# Altium schematic sheet 5_FTDI.SchDoc
size A4; SheetNumber: 6; SheetTotal: 13
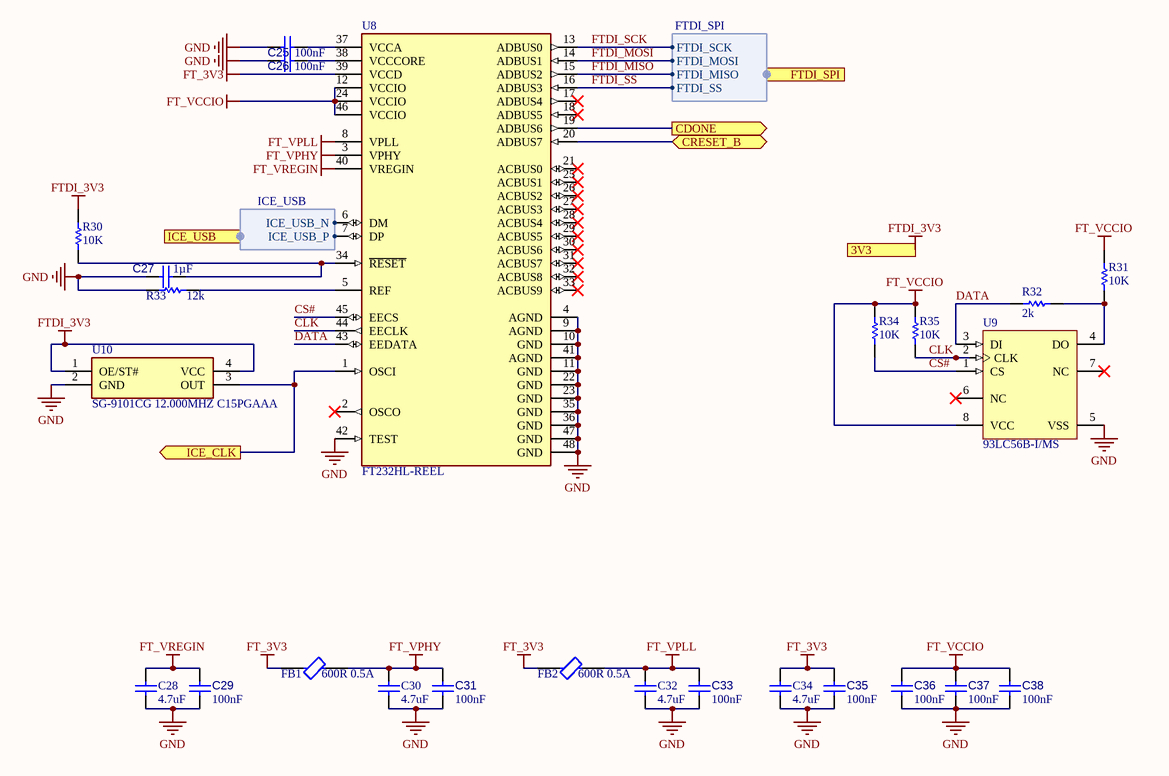
[diagram p0: 5_FTDI.SchDoc]

## Parts
C25  value 100nF  [CAPC1608X90X40NL10T20]  (hidden comment: Capacitor 100 nF +/-10% 50 V 0603)
C26  value 100nF  [CAPC1608X90X40NL10T20]  (hidden comment: Capacitor 100 nF +/-10% 50 V 0603)
C27  value 1µF  [CAPC1608X90X35ML15T15]  (hidden comment: Capacitor 1uF +/- 10% 16V 0603)
C28  4.7uF  [CAPC1608X90X35ML15T15]
C29  value 100nF  [CAPC1608X90X40NL10T20]  (hidden comment: Capacitor 100 nF +/-10% 50 V 0603)
C30  4.7uF  [CAPC1608X90X35ML15T15]
C31  value 100nF  [CAPC1608X90X40NL10T20]  (hidden comment: Capacitor 100 nF +/-10% 50 V 0603)
C32  4.7uF  [CAPC1608X90X35ML15T15]
C33  value 100nF  [CAPC1608X90X40NL10T20]  (hidden comment: Capacitor 100 nF +/-10% 50 V 0603)
C34  4.7uF  [CAPC1608X90X35ML15T15]
C35  value 100nF  [CAPC1608X90X40NL10T20]  (hidden comment: Capacitor 100 nF +/-10% 50 V 0603)
C36  value 100nF  [CAPC1608X90X40NL10T20]  (hidden comment: Capacitor 100 nF +/-10% 50 V 0603)
C37  value 100nF  [CAPC1608X90X40NL10T20]  (hidden comment: Capacitor 100 nF +/-10% 50 V 0603)
C38  value 100nF  [CAPC1608X90X40NL10T20]  (hidden comment: Capacitor 100 nF +/-10% 50 V 0603)
FB1  600R 0.5A  [FP-MMZ1608-0_8-IPC_A]
FB2  600R 0.5A  [FP-MMZ1608-0_8-IPC_A]
R30  10K  [RESC1609X55X30NL10T20]
R31  10K  [RESC1609X55X30NL10T20]
R32  2k  [RESC1609X55X30NL10T20]
R33  12k  [RESC1609X55X30NL10T20]
R34  10K  [RESC1609X55X30NL10T20]
R35  10K  [RESC1609X55X30NL10T20]
U8  FT232HL-REEL  [FP-LQFP-48-MFG]
U9  93LC56B-I/MS  [MSOP-MS8_M]
U10  SG-9101CG 12.000MHZ C15PGAAA  [OSC-SMD_4P-L2.5-W2.0-BL_CTS_CA25]

## Ports
3V3, CDONE (out), CRESET_B (bidir), FTDI_SPI (harness FTDI_SPI), ICE_CLK (out), ICE_USB (harness ICE_USB)

## Harnesses
FTDI_SPI: FTDI_SS, FTDI_MOSI, FTDI_SCK, FTDI_MISO
ICE_USB: ICE_USB_N, ICE_USB_P

## Nets
FT_3V3: C34.1 C35.1 FB1.1 FB2.1 U8.39(VCCD)
FT_VCCIO: C36.1 C37.1 C38.1 R31.2 R34.2 R35.2 U8.12(VCCIO) U8.24(VCCIO) U8.46(VCCIO) U9.8(VCC)
FT_VPHY: C30.1 C31.1 FB1.2 U8.3(VPHY)
FT_VPLL: C32.1 C33.1 FB2.2 U8.8(VPLL)
FT_VREGIN: C28.1 C29.1 U8.40(VREGIN)
FTDI_3V3: R30.2 U10.1(OE/ST#) U10.4(VCC) ; port 3V3
GND: C25.2 C26.2 C27.2 C28.2 C29.2 C30.2 C31.2 C32.2 C33.2 C34.2 C35.2 C36.2 C37.2 C38.2 R33.2 U8.4(AGND) U8.9(AGND) U8.10(GND) U8.11(GND) U8.22(GND) U8.23(GND) U8.35(GND) U8.36(GND) U8.41(AGND) U8.42(TEST) U8.47(GND) U8.48(GND) U9.5(VSS) U10.2(GND)
CDONE: U8.19(ADBUS6) ; port CDONE
CLK: R35.1 U8.44(EECLK) U9.2(CLK)
CRESET_B: U8.20(ADBUS7) ; port CRESET_B
CS#: R34.1 U8.45(EECS) U9.1(CS)
DATA: R32.2 U8.43(EEDATA) U9.3(DI)
FTDI_MISO: U8.15(ADBUS2) ; port FTDI_SPI.FTDI_MISO
FTDI_MOSI: U8.14(ADBUS1) ; port FTDI_SPI.FTDI_MOSI
FTDI_SCK: U8.13(ADBUS0) ; port FTDI_SPI.FTDI_SCK
FTDI_SS: U8.16(ADBUS3) ; port FTDI_SPI.FTDI_SS
ICE_CLK: U8.1(OSCI) U10.3(OUT) ; port ICE_CLK
NetC25_1: C25.1 U8.37(VCCA)
NetC26_1: C26.1 U8.38(VCCCORE)
NetC27_1: C27.1 R30.1 U8.34(~{RESET})
NetR31_1: R31.1 R32.1 U9.4(DO)
NetR33_1: R33.1 U8.5(REF)
NetU8_6: U8.6(DM) ; port ICE_USB.ICE_USB_N
NetU8_7: U8.7(DP) ; port ICE_USB.ICE_USB_P

Not connected (* = marked no-connect by the designer): U8 2(OSCO)* 17(ADBUS4)* 18(ADBUS5)* 21(ACBUS0)* 25(ACBUS1)* 26(ACBUS2)* 27(ACBUS3)* 28(ACBUS4)* 29(ACBUS5)* 30(ACBUS6)* 31(ACBUS7)* 32(ACBUS8)* 33(ACBUS9)*; U9 6(NC)* 7(NC)*

## Notes on the sheet
- Date:
- A4
- Project:
- Time:
- Sheet
- of
- Revision:
- File:
- Drawn By:

## Library data of the parts
C25 C26 C29 C31 C33 C35-C38 = CMP-001-00017-6: Chip Capacitor, 100 nF, +/- 10%, 50 V, 0603 (1608 Metric); Voltage Rating: 50V; Capacitor Type: Ceramic; Tolerance: 10%; Mounting Technology: SM; Max Operating Temperature: 125°C; RoHS Compliant: True; Pins: 2; Case/Package: 0603; Min Operating Temperature: -55°C
C27 = CMP-001-00004-6: Chip Capacitor, 1 uF, +/- 10%, 16 V, 0603 (1608 Metric); Capacitor Type: Ceramic; Mounting Technology: SM; RoHS Compliant: True; Min Operating Temperature: -55°C; Case/Package: 0603; Pins: 2; Voltage Rating: 16V; Max Operating Temperature: 125°C; Tolerance: 10%
C28 C30 C32 C34 = CMP-2006-02288-1: Part Number: C0603C475K9PAC7411; Manufacturer: Kemet
FB1 FB2 = CMP-08257-000171-1: Signal Line Ferrite Bead 600Ω  @ 100MHz 500mA DCR 400mΩ SMD 0603; Tolerance: 25%; DC Resistance (DCR): 400mR; REACH SVHC: No SVHC; RoHS Compliant: Yes; Case Code (Metric): 1608; Current Rating: 500mA; Package Quantity: 1; Width: 0.031inch; Number of Pins: 2; Case/Package: 0603; Case Code (Imperial): 0603; Packaging: Tape and Reel; Max DC Current: 500mA; Length: 0.063inch; Impedance: 600R; Mount: Surface Mount; Series: MMZ; Height: 0.037inch; Core Material: Ferrite
R30-R35 = CMP-2000-03692-1: Manufacturer: Vishay Dale; Part Number: TNPW060310K0BEEN
U8 = CMP-0078-00035-4: IC HS USB TO UART/FIFO 48LQFP; Interface: UART; Data Rate: 12Mbps; Number of Channels: 1; Operating Supply Voltage: 3.3V; Min Supply Voltage: 2.97V; Operating Supply Current: 24mA; Max Supply Voltage: 3.63V; Nominal Supply Current: 60mA; Width: 7mm; Height: 1.4mm; Weight: 0.006409oz; Min Operating Temperature: -40°C; Number of Pins: 48; Case/Package: LQFP; Lead Free: Lead Free; Package Quantity: 1; Packaging: Tape and Reel; Max Operating Temperature: 85°C; Length: 7mm; REACH SVHC: No SVHC; Mount: Surface Mount
U9 = CMP-0162-00478-1: 2K, 128x16-bit, 2.5V Microwire Serial EEPROM, 8-Pin MSOP, Industrial Temperature; PackageVersion: revBB, Aug-2009; PackageDescription: 8-Lead Plastic Micro Small Outline Package (MS) [MSOP]; DatasheetVersion: revF, May-2008; PackageReference: MSOP-MS8
U10 = SG-9101CG 12.000MHZ C15PGAAA: Operating Temperature:- Operating Temperature:-; Manufacturer: EPSON(爱普生); LCSC Part Name: 12MHz 1.62V~3.63V -40℃~+85℃; Supplier Part: C728996; Manufacturer Part: SG-9101CG 12.000MHz C15PGAAA; Supplier Footprint: SMD2520-4P; JLCPCB Part Class: Extended Part; Datasheet: https://item.szlcsc.com/datasheet/SG-9101CG%252012.000MHz%2520C15PGAAA/776678.html; Supplier: LCSC